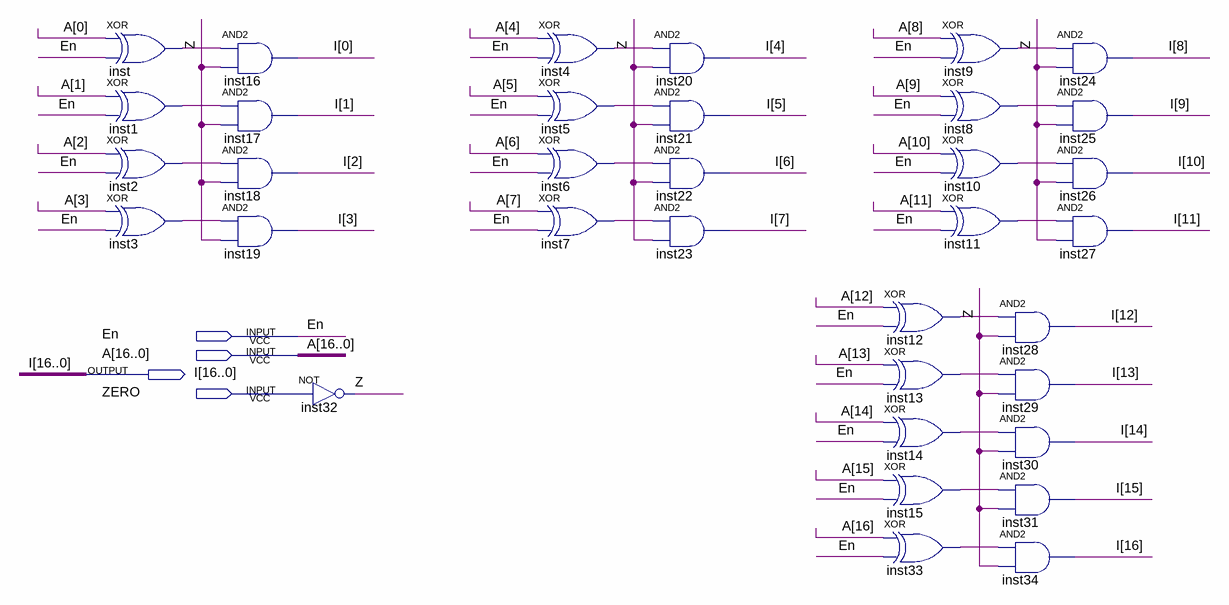
[diagram p0: schematic sheet]
// Quartus schematic InvertA.bdf as structural Verilog: 35 symbols, 4 pins
module InvertA (
  input  En,
  input  [16:0] A,
  input  ZERO,
  output [16:0] I
);

  wire inst1_out, inst2_out, inst3_out, inst4_out, inst5_out, inst6_out, inst7_out, inst8_out, inst9_out,
       inst10_out, inst11_out, inst12_out, inst13_out, inst14_out, inst15_out, inst33_out, inst_out, Z;

  xor inst (inst_out, A[0], En);
  xor inst1 (inst1_out, A[1], En);
  xor inst2 (inst2_out, A[2], En);
  xor inst3 (inst3_out, A[3], En);
  and inst16 (I[0], inst_out, Z);
  and inst17 (I[1], inst1_out, Z);
  and inst18 (I[2], inst2_out, Z);
  and inst19 (I[3], inst3_out, Z);
  not inst32 (Z, ZERO);
  xor inst4 (inst4_out, A[4], En);
  xor inst5 (inst5_out, A[5], En);
  xor inst6 (inst6_out, A[6], En);
  xor inst7 (inst7_out, A[7], En);
  and inst20 (I[4], inst4_out, Z);
  and inst21 (I[5], inst5_out, Z);
  and inst22 (I[6], inst6_out, Z);
  and inst23 (I[7], inst7_out, Z);
  xor inst12 (inst12_out, A[12], En);
  xor inst13 (inst13_out, A[13], En);
  xor inst14 (inst14_out, A[14], En);
  xor inst15 (inst15_out, A[15], En);
  xor inst33 (inst33_out, A[16], En);
  xor inst9 (inst9_out, A[8], En);
  xor inst8 (inst8_out, A[9], En);
  xor inst10 (inst10_out, A[10], En);
  xor inst11 (inst11_out, A[11], En);
  and inst28 (I[12], inst12_out, Z);
  and inst29 (I[13], inst13_out, Z);
  and inst30 (I[14], inst14_out, Z);
  and inst31 (I[15], inst15_out, Z);
  and inst34 (I[16], inst33_out, Z);
  and inst24 (I[8], inst9_out, Z);
  and inst25 (I[9], inst8_out, Z);
  and inst26 (I[10], inst10_out, Z);
  and inst27 (I[11], inst11_out, Z);
endmodule
